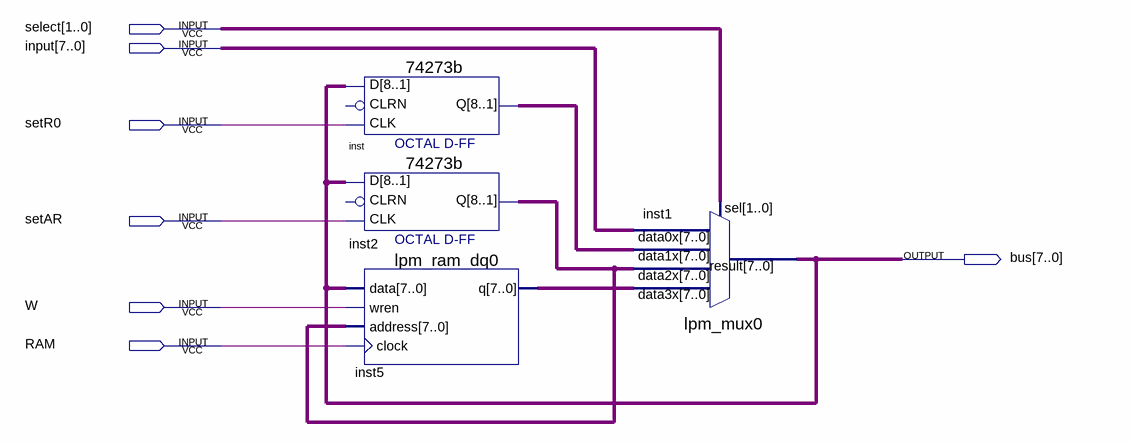
[diagram p0: schematic sheet]
// Quartus schematic Chapter5.bdf as structural Verilog: 4 symbols, 7 pins
module Chapter5 (
  input  [1:0] select,
  input  [7:0] \input ,
  input  setR0,
  input  setAR,
  input  W,
  input  RAM,
  output [7:0] bus
);

  wire [7:0] inst2_q, inst5_q, inst_q;

  \74273b  inst (.CLK(setR0), .D(bus), .Q(inst_q));  // open: CLRN
  \74273b  inst2 (.CLK(setAR), .D(bus), .Q(inst2_q));  // open: CLRN
  lpm_ram_dq0 inst5 (.data(bus), .wren(W), .address(inst2_q), .clock(RAM), .q(inst5_q));
  lpm_mux0 inst1 (.data3x(inst5_q), .data2x(inst2_q), .data1x(inst_q), .data0x(\input ), .sel(select), .result(bus));
endmodule
